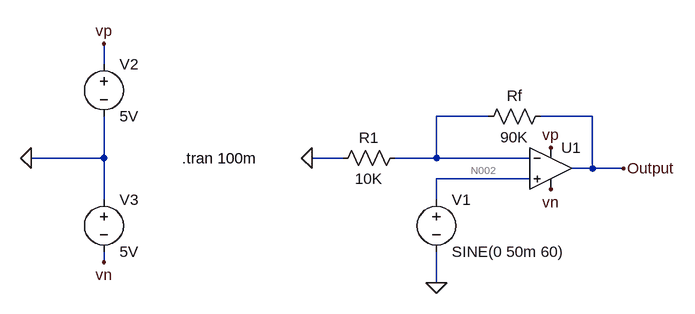
[diagram p0: schematic Ideal Op_Amp.asc]
Ideal Op_Amp.asc, the LTspice schematic file:
Version 4.1
SHEET 1 880 680
WIRE -496 -16 -496 -48
WIRE 96 64 16 64
WIRE 256 64 176 64
WIRE -496 128 -496 64
WIRE -496 128 -608 128
WIRE -128 128 -176 128
WIRE 16 128 16 64
WIRE 16 128 -48 128
WIRE 160 128 16 128
WIRE 256 144 256 64
WIRE 256 144 224 144
WIRE 304 144 256 144
WIRE 160 160 16 160
WIRE -496 192 -496 128
WIRE 16 192 16 160
WIRE -496 288 -496 272
WIRE 16 320 16 272
FLAG 304 144 Output
FLAG 192 112 vp
FLAG 192 176 vn
FLAG 16 320 0
FLAG -608 128 0
FLAG -176 128 0
FLAG -496 -48 vp
FLAG -496 288 vn
SYMBOL OpAmps\\UniversalOpAmp2 192 144 R0
SYMATTR InstName U1
SYMBOL voltage 16 176 R0
WINDOW 123 0 0 Left 0
WINDOW 39 0 0 Left 0
SYMATTR InstName V1
SYMATTR Value SINE(0 50m 60)
SYMBOL res 192 48 R90
WINDOW 0 0 56 VBottom 2
WINDOW 3 32 56 VTop 2
SYMATTR InstName Rf
SYMATTR Value 90K
SYMBOL res -32 112 R90
WINDOW 0 0 56 VBottom 2
WINDOW 3 32 56 VTop 2
SYMATTR InstName R1
SYMATTR Value 10K
SYMBOL voltage -496 -32 R0
WINDOW 123 0 0 Left 0
WINDOW 39 0 0 Left 0
SYMATTR InstName V2
SYMATTR Value 5V
SYMBOL voltage -496 176 R0
WINDOW 123 0 0 Left 0
WINDOW 39 0 0 Left 0
SYMATTR InstName V3
SYMATTR Value 5V
TEXT -376 128 Left 2 !.tran 100m

The netlist it stands for:
* Ideal Op_Amp.asc
X§U1 N002 N001 vp vn Output level2 Avol=1Meg GBW=10Meg Slew=10Meg Ilimit=25m Rail=0 Vos=0 En=0 Enk=0 In=0 Ink=0 Rin=500Meg  ; pins In+ In- V+ V- OUT
V1 N002 0 SINE(0 50m 60)
Rf Output N001 90K
R1 N001 0 10K
V2 vp 0 5V
V3 0 vn 5V
.tran 100m
.lib UniversalOpAmp2.lib
.backanno
.end

* Results of the author's LTspice run, read from the files saved beside the schematic
* Operating Point, zero values left out:
*   V(vn) = -5 V
*   V(vp) = 5 V
*   I(V2) = -500 µA
*   I(V3) = -500 µA
*   Ix(u1:3) = 500 µA
*   Ix(u1:4) = -500 µA
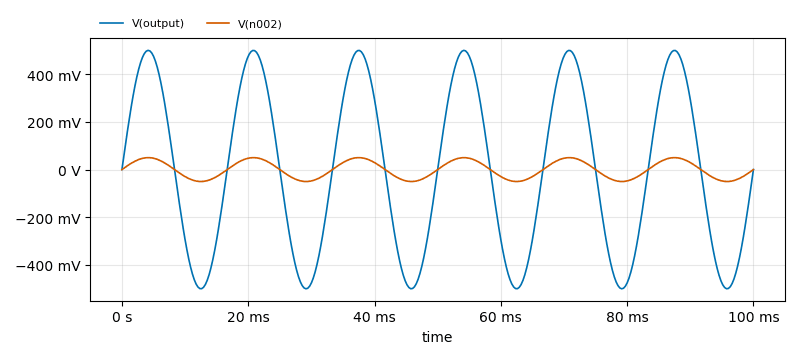
[diagram p1: Transient Analysis of Ideal Op_Amp.asc, plotted from the saved traces]
* Transient Analysis, 1 run:
*   V(output): min -500 mV, max 500 mV, average -89.4 nV, rms 353.6 mV, last -30.14 µV
*   V(n002): min -50 mV, max 50 mV, average -8.944 nV, rms 35.36 mV, last 0 V